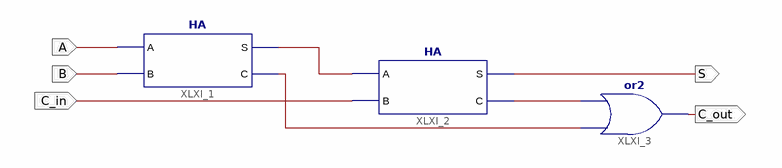
[diagram p0: schematic sheet 1]
// Xilinx ISE schematic FA.sch (spartan3e) as structural Verilog: 3 symbols, 5 ports
module FA (
  input  A,
  input  B,
  input  C_in,
  output S,
  output C_out
);

  wire XLXN_1, XLXN_7, XLXN_9;

  HA XLXI_1 (.A(A), .B(B), .C(XLXN_9), .S(XLXN_1));
  HA XLXI_2 (.A(XLXN_1), .B(C_in), .C(XLXN_7), .S(S));
  or XLXI_3 (C_out, XLXN_9, XLXN_7);
endmodule
